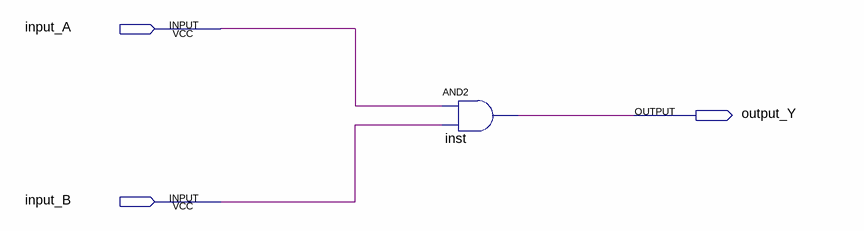
[diagram p0: schematic sheet]
// Quartus schematic and_gate.bdf as structural Verilog: 1 symbols, 3 pins
module and_gate (
  input  input_A,
  input  input_B,
  output output_Y
);

  and inst (output_Y, input_A, input_B);
endmodule
